# EAGLE design quadcopter (EAGLE 9.7.0)
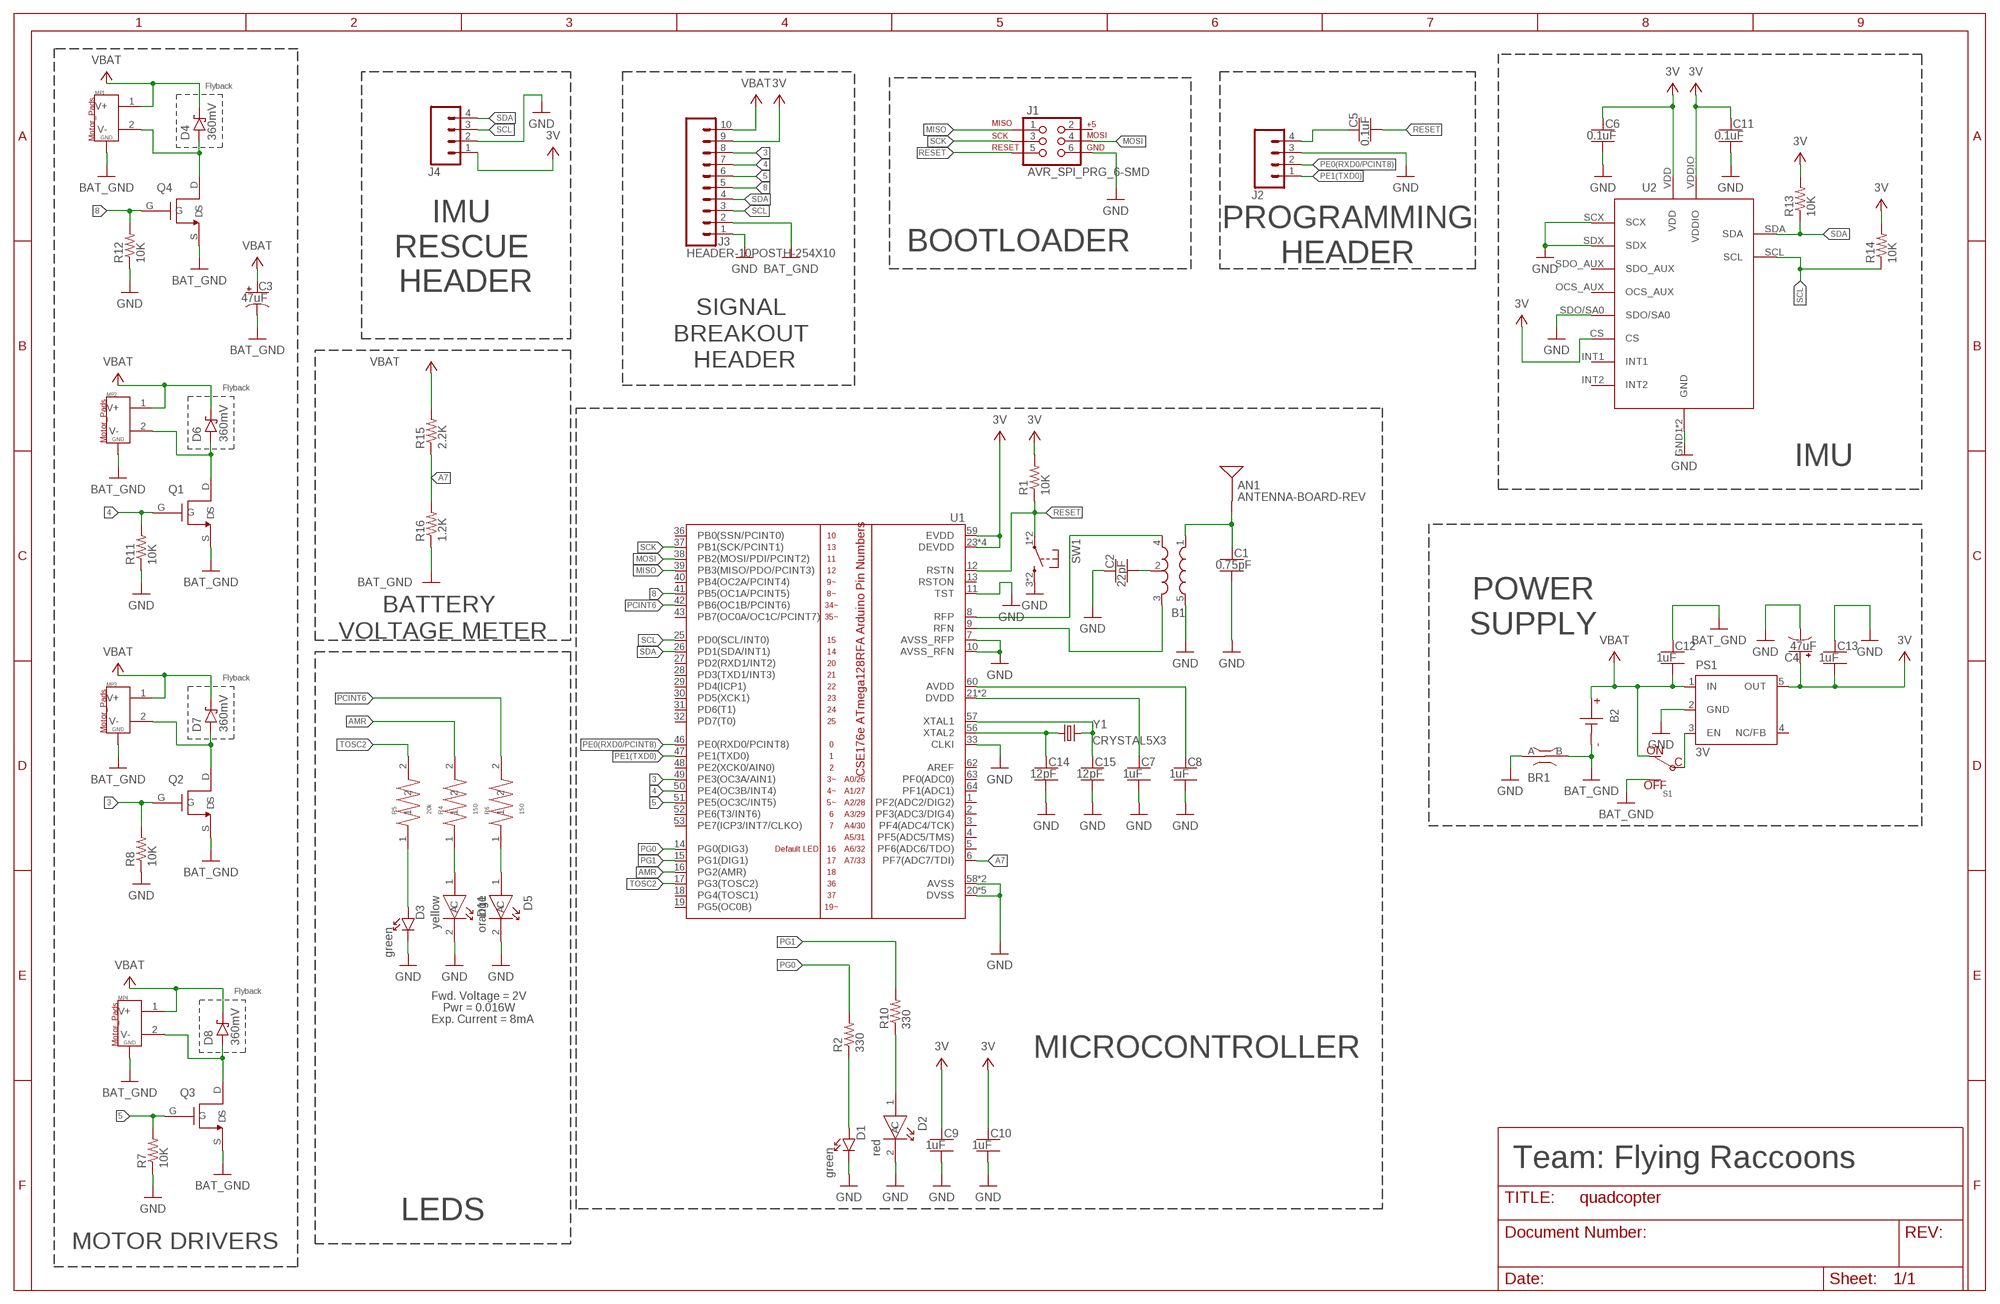
[diagram p0: schematic, sheet 1]
FRAME1 (FRAME_B_L): CREATOR: Unknown; DIST: Unknown; DISTPN: Unknown

## Parts
AN1  ANTENNA-BOARD-REV  [ANT_PCB_2.4GHZ_NRF8001_1.6MM_1OZ_REV]
B1  BALUN0805  [BALUN]
B2  BATTERY-SCREW-TERMINAL  [SCREW-TERMINAL-1X2-2.54MM]
BR1  NET_BRIDGE-NET-BRIDGE  [BRIDGE]
C1  0.75pF  CAPACITOR-NP_SMD-2012-0805_CERAMIC-0.75PF  [CAPC2012X140_HS]
C2  22pF  CAPACITOR-NP_SMD-2012-0805_CERAMIC-22PF  [CAPC2012X140_HS]
C3  47uF  CAPACITOR-POL_47UF-SMD-1206-TAJA  [CAPMP3216X180]
C4  47uF  CAPACITOR-POL_47UF-SMD-1206-TAJA  [CAPMP3216X180]
C5  0.1uF  CAPACITOR-NP_SMD-2012-0805_CERAMIC-0.1UF  [CAPC2012X140_HS]
C6  0.1uF  CAPACITOR-NP_SMD-2012-0805_CERAMIC-0.1UF  [CAPC2012X140_HS]
C7  1uF  CAPACITOR-NP_SMD-2012-0805_CERAMIC-1UF  [CAPC2012X140_HS]
C8  1uF  CAPACITOR-NP_SMD-2012-0805_CERAMIC-1UF  [CAPC2012X140_HS]
C9  1uF  CAPACITOR-NP_SMD-2012-0805_CERAMIC-1UF  [CAPC2012X140_HS]
C10  1uF  CAPACITOR-NP_SMD-2012-0805_CERAMIC-1UF  [CAPC2012X140_HS]
C11  0.1uF  CAPACITOR-NP_SMD-2012-0805_CERAMIC-0.1UF  [CAPC2012X140_HS]
C12  1uF  CAPACITOR-NP_SMD-2012-0805_CERAMIC-1UF  [CAPC2012X140_HS]
C13  1uF  CAPACITOR-NP_SMD-2012-0805_CERAMIC-1UF  [CAPC2012X140_HS]
C14  12pF  CAPACITOR-NP_SMD-2012-0805_CERAMIC-12PF  [CAPC2012X140_HS]
C15  12pF  CAPACITOR-NP_SMD-2012-0805_CERAMIC-12PF  [CAPC2012X140_HS]
D1  green  DIODE-LED_SMD-2012-0805-GREEN  [LEDSC125X200X120-2_HS]
D2  red  LED-RED_D-C170EKT  [LED-LTST-C170EKT]
D3  green  DIODE-LED_SMD-2012-0805-GREEN  [LEDSC125X200X120-2_HS]
D4  360mV  DIODE-SCHOTTKY_-SMD-SOD123  [SODFL3516X96]
D5  orange  LED-ORANGE_D-LOR976  [LED-LTST-C170EKT]
D6  360mV  DIODE-SCHOTTKY_-SMD-SOD123  [SODFL3516X96]
D7  360mV  DIODE-SCHOTTKY_-SMD-SOD123  [SODFL3516X96]
D8  360mV  DIODE-SCHOTTKY_-SMD-SOD123  [SODFL3516X96]
D11  yellow  LED-YELLOW_D-LYR976  [LED-LTST-C170EKT]
J1  AVR_SPI_PRG_6-SMD  [2X3-SMD]
J2  HEADER-4POS-0.1IN-FEMALE-SMD-BOTTOM-ENTRY  [HEADER-1X4-BOTTOM-ENTRY]
J3  HEADER-10POSTH-254X10  [HDRV10W63P254_10X1_2540X254H838_HS]
J4  HEADER-4POS-0.1IN-FEMALE-SMD-BOTTOM-ENTRY  [HEADER-1X4-BOTTOM-ENTRY]
MP1  MOTOR_PADS_GND-MOLEX-SMD  [MOLEX-0532610271]
MP2  MOTOR_PADS_GND-MOLEX-SMD  [MOLEX-0532610271]
MP3  MOTOR_PADS_GND-MOLEX-SMD  [MOLEX-0532610271]
MP4  MOTOR_PADS_GND-MOLEX-SMD  [MOLEX-0532610271]
PS1  3V  TPS73633-DBVT3V  [SOT23-DBV]
Q1  NMOSFET  [SOTFL95P237X112-3N]
Q2  NMOSFET  [SOTFL95P237X112-3N]
Q3  NMOSFET  [SOTFL95P237X112-3N]
Q4  NMOSFET  [SOTFL95P237X112-3N]
R1  10K  RESISTOR_SMD-2012-0805-10K  [RESC2012X60_HS]
R2  330  RESISTOR_SMD-2012-0805-330  [RESC2012X60_HS]
R4  150  RESISTOR-150R-0805  [0805_RESISTOR]
R5  20k  RESISTOR-20K-0805  [0805_RESISTOR]
R6  150  RESISTOR-150R-0805  [0805_RESISTOR]
R7  10K  RESISTOR_SMD-2012-0805-10K  [RESC2012X60_HS]
R8  10K  RESISTOR_SMD-2012-0805-10K  [RESC2012X60_HS]
R10  330  RESISTOR_SMD-2012-0805-330  [RESC2012X60_HS]
R11  10K  RESISTOR_SMD-2012-0805-10K  [RESC2012X60_HS]
R12  10K  RESISTOR_SMD-2012-0805-10K  [RESC2012X60_HS]
R13  10K  RESISTOR_SMD-2012-0805-10K  [RESC2012X60_HS]
R14  10K  RESISTOR_SMD-2012-0805-10K  [RESC2012X60_HS]
R15  2.2K  RESISTOR_SMD-2012-0805-2.2K  [RESC2012X60_HS]
R16  1.2K  RESISTOR_SMD-2012-0805-1.2K  [RESC2012X60_HS]
S1  POWER-SWITCH-MFS201N-9-Z-SMD-EDGE  [JS102011SAQN]
SW1  PUSHBUTTON_-4.5X4.5  [4.5MM_TACTILE_SWITCH_TL3305AF160QG]
U1  ATMEGA128RFA1  [QFN-64]
U2  IMU_LSM6DS0XTR-IMU-LSM6DS0XTR  [IMU_LSM6DS0XTR]
Y1  CRYSTAL5X3  [CRYSTAL-SMD-5X3]

## Nets
3: J3.8 Q2.G R8.2 U1.49(PE3(OC3A/AIN1))
3V [PWR]: C4.1(+) C6.1 C9.1 C10.1 C11.1 C13.2 J3.9 J4.1 PS1.5(OUT) R1.2 R13.2 R14.2 U1.23(DEVDD) U1.34(DEVDD) U1.44(DEVDD) U1.54(DEVDD) U1.59(EVDD) U2.CS U2.VDD U2.VDDIO
4: J3.7 Q1.G R11.2 U1.50(PE4(OC3B/INT4))
5: J3.6 Q3.G R7.2 U1.51(PE5(OC3C/INT5))
8: J3.5 Q4.G R12.2 U1.41(PB5(OC1A/PCINT5))
A7: R15.1 R16.2 U1.6(PF7(ADC7/TDI))
AMR: R4.2 U1.16(PG2(AMR))
BAT_GND [HIGHCURRENT]: B2.1(N) BR1.B C3.2(-) C12.1 J3.2 MP1.G1(GND) MP1.G2(GND) MP2.G1(GND) MP2.G2(GND) MP3.G1(GND) MP3.G2(GND) MP4.G1(GND) MP4.G2(GND) Q1.S Q2.S Q3.S Q4.S R16.1 S1.A(OFF)
GND [PWR]: B1.5(GND) BR1.A C1.2 C2.1 C4.2(-) C6.2 C7.2 C8.2 C9.2 C10.2 C11.2 C13.1 C14.2 C15.2 D1.C D2.2(C) D3.C D5.2(C) D11.2(C) J1.6 J2.3 J3.1 J4.2 PS1.2(GND) R7.1 R8.1 R11.1 R12.1 SW1.3 SW1.4 U1.7(AVSS_RFP) U1.10(AVSS_RFN) U1.11(TST) U1.20(DVSS) U1.24(DVSS) U1.33(CLKI) U1.35(DVSS) U1.45(DVSS) U1.55(DVSS) U1.58(AVSS) U1.61(AVSS) U2.GND1(GND) U2.GND2(GND) U2.SCX U2.SDO/SA0 U2.SDX
MISO: J1.1 U1.39(PB3(MISO/PDO/PCINT3))
MOSI: J1.4 U1.38(PB2(MOSI/PDI/PCINT2))
N$1: B1.4(OUT1) U1.8(RFP)
N$2: C15.1 U1.57(XTAL1) Y1.3
N$3: C14.1 U1.56(XTAL2) Y1.1
N$4: C7.1 U1.21(DVDD) U1.22(DVDD)
N$5: C8.1 U1.60(AVDD)
N$6: B1.3(OUT2) U1.9(RFN)
N$7: B1.2(GND) C2.2
N$8 [RFSIG]: AN1.FEED(SIGNAL) B1.1(IN) C1.1
N$9: D1.A R2.1
N$10: D2.1(A) R10.1
N$11: PS1.3(EN) S1.C
N$12: D3.A R5.1
N$13: D11.1(A) R4.1
N$14: D5.1(A) R6.1
N$15: C5.1 J2.4
N$16 [HIGHCURRENT]: D6.2(A) MP2.2(V-) Q1.D
N$17 [HIGHCURRENT]: D7.2(A) MP3.2(V-) Q2.D
N$18 [HIGHCURRENT]: D8.2(A) MP4.2(V-) Q3.D
N$19 [HIGHCURRENT]: D4.2(A) MP1.2(V-) Q4.D
PCINT6: R6.2 U1.42(PB6(OC1B/PCINT6))
PE0(RXD0/PCINT8): J2.2 U1.46(PE0(RXD0/PCINT8))
PE1(TXD0): J2.1 U1.47(PE1(TXD0))
PG0: R2.2 U1.14(PG0(DIG3))
PG1: R10.2 U1.15(PG1(DIG1))
RESET: C5.2 J1.5 R1.1 SW1.1 SW1.2 U1.12(RSTN)
SCK: J1.3 U1.37(PB1(SCK/PCINT1))
SCL: J3.3 J4.3 R14.1 U1.25(PD0(SCL/INT0)) U2.SCL
SDA: J3.4 J4.4 R13.1 U1.26(PD1(SDA/INT1)) U2.SDA
TOSC2: R5.2 U1.17(PG3(TOSC2))
VBAT [HIGHCURRENT]: B2.2(P) C3.1(+) C12.2 D4.1(C) D6.1(C) D7.1(C) D8.1(C) J3.10 MP1.1(V+) MP2.1(V+) MP3.1(V+) MP4.1(V+) PS1.1(IN) R15.2 S1.B(ON)
Unconnected: J1.2 PS1.4(NC/FB) U1.1(PF2(ADC2/DIG2)) U1.2(PF3(ADC3/DIG4)) U1.3(PF4(ADC4/TCK)) U1.4(PF5(ADC5/TMS)) U1.5(PF6(ADC6/TDO)) U1.13(RSTON) U1.18(PG4(TOSC1)) U1.19(PG5(OC0B)) U1.27(PD2(RXD1/INT2)) U1.28(PD3(TXD1/INT3)) U1.29(PD4(ICP1)) U1.30(PD5(XCK1)) U1.31(PD6(T1)) U1.32(PD7(T0)) U1.36(PB0(SSN/PCINT0)) U1.40(PB4(OC2A/PCINT4)) U1.43(PB7(OC0A/OC1C/PCINT7)) U1.48(PE2(XCK0/AIN0)) U1.52(PE6(T3/INT6)) U1.53(PE7(ICP3/INT7/CLKO)) U1.62(AREF) U1.63(PF0(ADC0)) U1.64(PF1(ADC1)) U2.INT1 U2.INT2 U2.OCS_AUX U2.SDO_AUX

## Notes on the sheet
- Flyback
- PROGRAMMING
  HEADER
- IMU 
  RESCUE 
  HEADER
- BOOTLOADER
- SIGNAL 
  BREAKOUT 
  HEADER
- Flyback
- IMU
- POWER
  SUPPLY
- BATTERY 
  VOLTAGE METER
- Flyback
- Flyback
- Fwd. Voltage = 2V
- Pwr = 0.016W
- Exp. Current = 8mA
- MICROCONTROLLER
- Team: Flying Raccoons
- LEDS
- MOTOR DRIVERS

## Library data of the parts
AN1 = quadparts_prebuilt_2022:ANTENNA: Single endded antenna.; CREATOR: Swanson; DESC: trace antenna; DIST: NA; DISTPN: NA; MFR: NA; MOUNTING: NONE; MPN: NA; POPULATE: NO
B1 = quadparts_prebuilt_2022:BALUN: A balun to convert differential radio-frequency outputs from the microcontroller into a single-ended driver for the antenna.; CREATOR: Swanson; DATASHEET: http://katalog.we-online.de/pbs/datasheet/748421245.pdf; DESC: BALUN 2.4GHZ-2.5GHZ 50/100 0805; DIST: Digikey; DISTPN: 732-2230-1-ND; MFR: Wurth Electronics Inc.; MOUNTING: SMD; MPN: 748421245; PACKAGE: 0805; PRICE: 2.63; REVIEWER: Swanson
B2 = quadparts_prebuilt_2022:BATTERY: Connections for a battery.; CREATOR: Swanson; DIST: DIGIKEY; DISTPN: ED10561-ND; MOUNTING: TH; PIN1: -; PIN2: +
BR1 = custom_anish:NET_BRIDGE; CREATOR: Anish Kulkarni; DIST: N/A; DISTPN: N/A
C1 = quadparts_prebuilt_2022:CAPACITOR-NP_: Nonpolarized capacitor; CREATOR: Swanson; DESC: CAP CER 0.75PF 100V C0G/NP0 0805; DIST: Digikey; DISTPN: 490-3585-1-ND; MFR: Murata Electronics; MOUNTING: SMD; MPN: GQM2195C2AR75CB01D; PACKAGE: 0805; REVIEWER: Swanson
C2 = quadparts_prebuilt_2022:CAPACITOR-NP_: Nonpolarized capacitor; CREATOR: Swanson; DESC: CAP CER 22PF 250V C0G/NP0 0805; DIST: Digikey; DISTPN: 490-5534-1-ND; MFR: Murata Electronics; MOUNTING: SMD; MPN: GRM21A5C2E220JW01D; PACKAGE: 0805; REVIEWER: Swanson
C3 C4 = quadparts_prebuilt_2022:CAPACITOR-POL_: Polarized capacitor; CREATOR: Swanson; DESC: CAP TANT 47UF 10% 6.3V 1206; DIST: DIGIKEY; DISTPN: 478-11462-1-ND; MFR: AVX Corporation; MOUNTING: SMD; MPN: TAJA476K006SNJV; PACKAGE: 1206
C5 C6 C11 = quadparts_prebuilt_2022:CAPACITOR-NP_: Nonpolarized capacitor; CREATOR: Swanson; DESC: CAP CER 0.1UF 100V X7R 0805; DIST: Digikey; DISTPN: 445-1418-1-ND; MFR: TDK Corporation; MOUNTING: SMD; MPN: C2012X7R2A104K125AA; PACKAGE: 0805; REVIEWER: Swanson
C7-C10 C12 C13 = quadparts_prebuilt_2022:CAPACITOR-NP_: Nonpolarized capacitor; CREATOR: Swanson; DIST: Digikey; DISTPN: 587-1281-1-ND; MFR: Taiyo Yuden; MOUNTING: SMD; MPN: TMK212B7105KG-T; REVIEWER: Swanson
C14 C15 = quadparts_prebuilt_2022:CAPACITOR-NP_: Nonpolarized capacitor; CREATOR: Swanson; DESC: CAP CER 12PF 250V C0G/NP0 0805; DIST: Digikey; DISTPN: 490-5531-1-ND; MFR: Murata Electronics; MOUNTING: SMD; MPN: GRM21A5C2E120JW01D; PACKAGE: 0805; REVIEWER: Swanson
D1 D3 = quadparts_prebuilt_2022:DIODE-LED_: Light emitting diode; CREATOR: Swanson; DIST: Digikey; DISTPN: 160-1179-1-ND; MFR: Lite-On Inc; MOUNTING: SMD; MPN: LTST-C170GKT; REVIEWER: Swanson
D2 = custom_anish:LED; CREATOR: Anish Kulkarni; DIST: Digikey; DISTPN: 160-1178-1-ND
D4 D6-D8 = quadparts_prebuilt_2022:DIODE-SCHOTTKY_: Schottky diode; CREATOR: Swanson; DESC: DIODE SCHOTTKY 30V 1.5A SFLAT; DIST: Digikey; DISTPN: CRS08QMCT-ND; MFR: Toshiba Semiconductor and Storage; MOUNTING: SMD; MPN: CRS08(TE85L,Q,M); REVIEWER: Swanson
D5 = custom_anish:LED; CREATOR: Anish Kulkarni; DIST: Digikey; DISTPN: 475-LOR976-PS-1CT-ND
D11 = custom_anish:LED; CREATOR: Anish Kulkarni; DIST: Digikey; DISTPN: 475-LYR976-PS-36-0-20-R18CT-ND
J1 = quadparts_prebuilt_2022:AVR_SPI_PRG_6: AVR ISP 6 Pin This is the in-system programming (ISP) connector for Atmel Microcontrollers programming.; CREATOR: Swanson; DESC: CONN HEADER SMD 6POS 2.54MM; DIST: Digikey; DISTPN: 609-3487-2-ND; MFR: Amphenol ICC (FCI); MOUNTING: SMD; MPN: 95278-101A06LF
J2 J4 = quadparts_prebuilt_2022:HEADER-4POS; CREATOR: Swanson; DESC: CONN RCPT 4POS 0.1 GOLD SMD; DIST: DIGIKEY; DISTPN: A121787CT-ND; MFR: TE Connectivity AMP Connectors; MOUNTING: SMD; MPN: 1241152-4
J3 = quadparts_prebuilt_2022:HEADER-10POS: 10 pin single inline pin header, socket, or connector; CREATOR: Swanson; DATASHEET: http://portal.fciconnect.com/Comergent//fci/drawing/68000.pdf; DIST: Digikey; DISTPN: 609-3250-ND; MFR: Amphenol FCI; MOUNTING: TH; MPN: 68000-110HLF; PRICE: 0.55; REVIEWER: Swanson
MP1-MP4 = quadparts_prebuilt_2022:MOTOR_PADS_GND: Connections a brushed motor.; CREATOR: Swanson; DESC: CONN HEADER SMD R/A 2POS 1.25MM; DIST: DIGIKEY; DISTPN: WM7620CT-ND; MFR: Molex; MOUNTING: SMD; MPN: 532610271
PS1 = quadparts_prebuilt_2022:TPS73633-DBVT: LP3985-series voltage regulators.; CREATOR: Swanson; DATASHEET: http://www.ti.com/lit/ds/symlink/lp3985.pdf; DIST: Digikey; DISTPN: LP3985IM5X-3.0/NOPBCT-ND; MFR: Texas Instruments; MOUNTING: SMD; MPN: LP3985IM5X-3.0/NOPB; PRICE: 0.59; REVIEWER: Swanson
Q1-Q4 = custom_girish:NMOSFET; CREATOR: GIRISH K; DIST: Digikey; DISTPN: SI2302CDS-T1-E3CT-ND
R1 R7 R8 R11-R14 = quadparts_prebuilt_2022:RESISTOR_: Resistor; CREATOR: Swanson; DESC: RES SMD 10K OHM 5% 1/8W 0805; DIST: Digikey; DISTPN: 311-10KARCT-ND; MFR: Yageo; MOUNTING: SMD; MPN: RC0805JR-0710KL; PACKAGE: 0805; REVIEWER: Swanson
R2 R10 = quadparts_prebuilt_2022:RESISTOR_: Resistor; CREATOR: Swanson; DIST: Digikey; DISTPN: 311-330ARCT-ND; MFR: Yageo; MOUNTING: SMD; MPN: RC0805JR-07330RL; REVIEWER: Swanson
R4 R6 = custom_girish:RESISTOR; CREATOR: GIRISH K; DIST: Digikey; DISTPN: CR0805-FX-1500ELFCT-ND
R5 = custom_girish:RESISTOR; CREATOR: GIRISH K; DIST: Digikey; DISTPN: P20KDACT-ND
R15 = quadparts_prebuilt_2022:RESISTOR_: Resistor; CREATOR: SWANSON; DIST: DIGIKEY; DISTPN: YAG3776CT-ND; MOUNTING: SMD
R16 = quadparts_prebuilt_2022:RESISTOR_: Resistor; CREATOR: Swanson; DESC: RES SMD 1.2K OHM 1% 1/8W 0805; DIST: DIGIKEY; DISTPN: 311-1.20KCRCT-ND; MFR: Yageo; MOUNTING: SMD; MPN: RC0805FR-071K2L; PACKAGE: 0805
S1 = quadparts_prebuilt_2022:POWER-SWITCH-MFS201N-9-Z; CREATOR: Swanson; DESC: SWITCH SLIDE SPDT 300MA 6V; DIST: DIGIKEY; DISTPN: 401-1999-1-ND; MFR: C&K; MOUNTING: SMD; MPN: JS102011SAQN
SW1 = quadparts_prebuilt_2022:PUSHBUTTON_: "Tactile" or "clicky" button.; CREATOR: Swanson; DESC: SWITCH TACTILE SPST-NO 50MA 12V; DIST: DIGIKEY; DISTPN: EG5350CT-ND; MFR: E-Switch; MOUNTING: SMD; MPN: TL3305AF160QG
U1 = quadparts_prebuilt_2022:ATMEGA128RFA1: ATmega128RFA1 8-bit AVR Microcontroller with Low Power 2.4GHz Transceiver for ZigBee and IEEE 802.15.4; CREATOR: Swanson; DATASHEET: http://www.atmel.com/Images/Atmel-8266-MCU_Wireless-ATmega128RFA1_Datasheet.pdf; DESC: IC RF TXRX+MCU 802.15.4 64VFQFN; DIST: Digikey; DISTPN: ATMEGA128RFA1-ZU-ND; MFR: Microchip Technology; MOUNTING: SMD; MPN: ATMEGA128RFA1-ZU; PACKAGE: QFN; PRICE: 10.21; REVIEWER: Swanson
U2 = custom_girish:IMU_LSM6DS0XTR; CREATOR: GIRISH K; DIST: Digikey; DISTPN: 497-18367-1-ND
Y1 = quadparts_prebuilt_2022:CRYSTAL: Crystals to provide clock references for microcontrollers, etc.; CREATOR: Swanson; DATASHEET: http://www.abracon.com/Resonators/abm3b.pdf; DESC: CRYSTAL 16.0000MHZ 18PF SMD; DIST: Digikey; DISTPN: 535-9122-1-ND; MFR: Abracon LLC; MOUNTING: SMD; MPN: ABM3B-16.000MHZ-B2-T; PRICE: 0.68; PROD_ID: XTAL-08218; REVIEWER: Swanson

## Net classes
1 RFSIG: width 1.27 mm
2 PWR: width 0.254 mm
3 HIGHCURRENT: width 0.762 mm, drill 0.61 mm

## Board
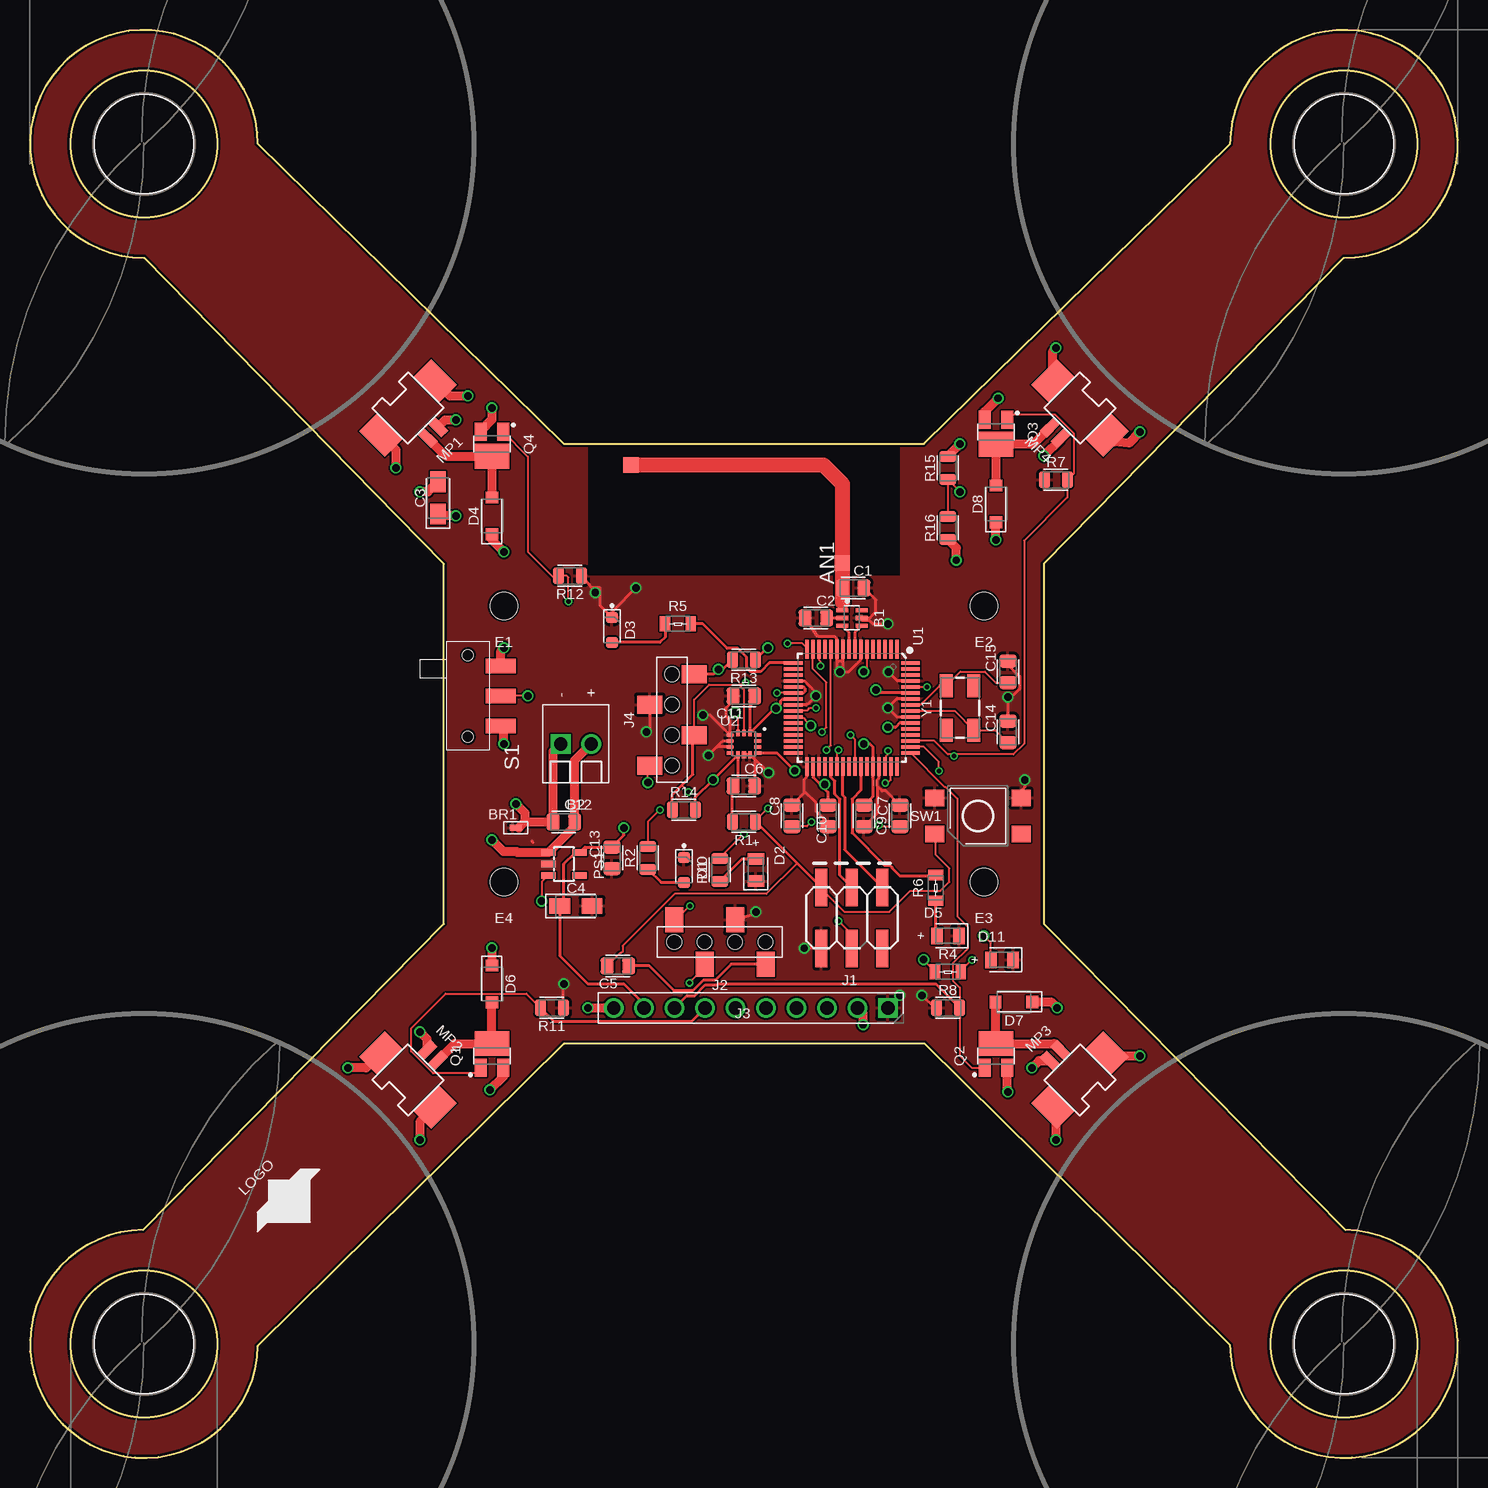
[diagram p1: board, top side]
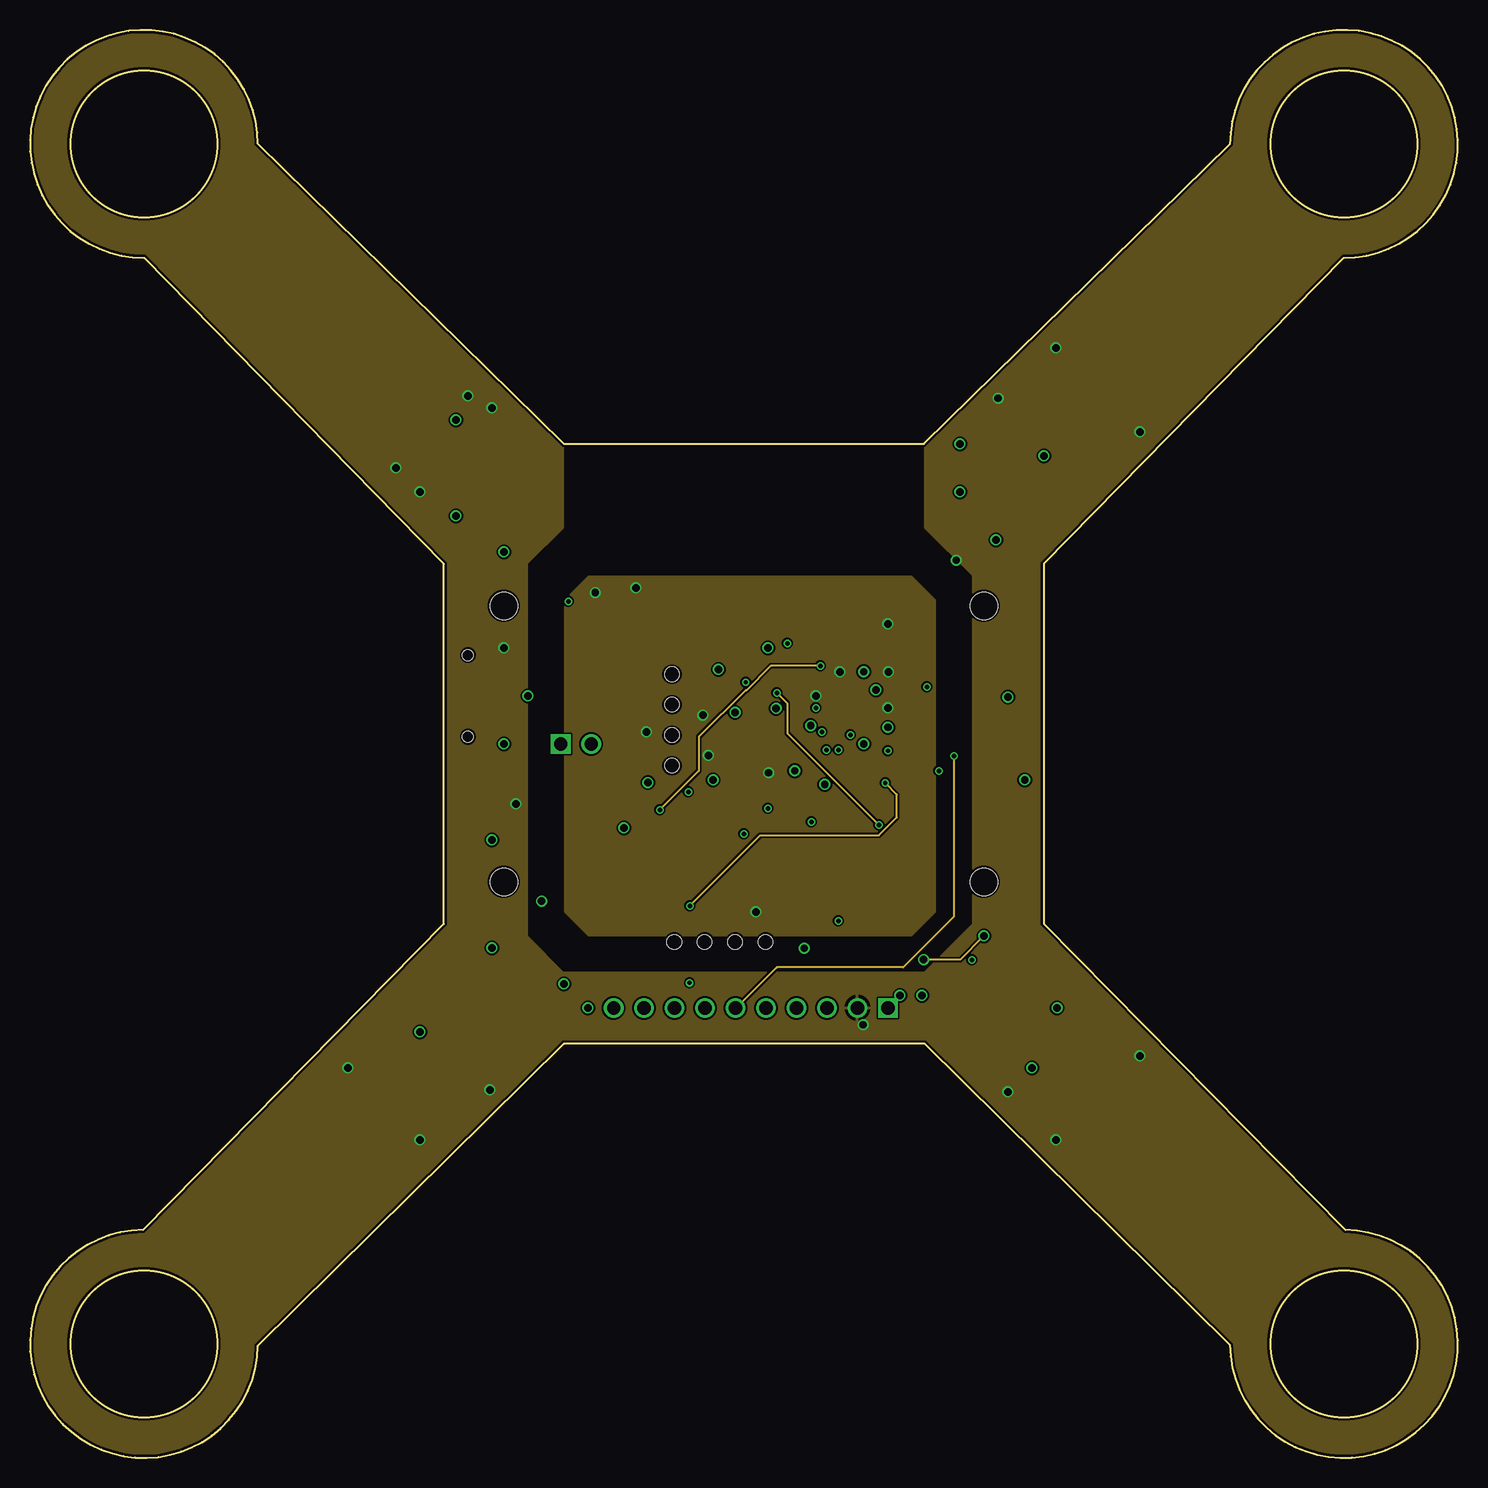
[diagram p2: board, inner layer Route2]
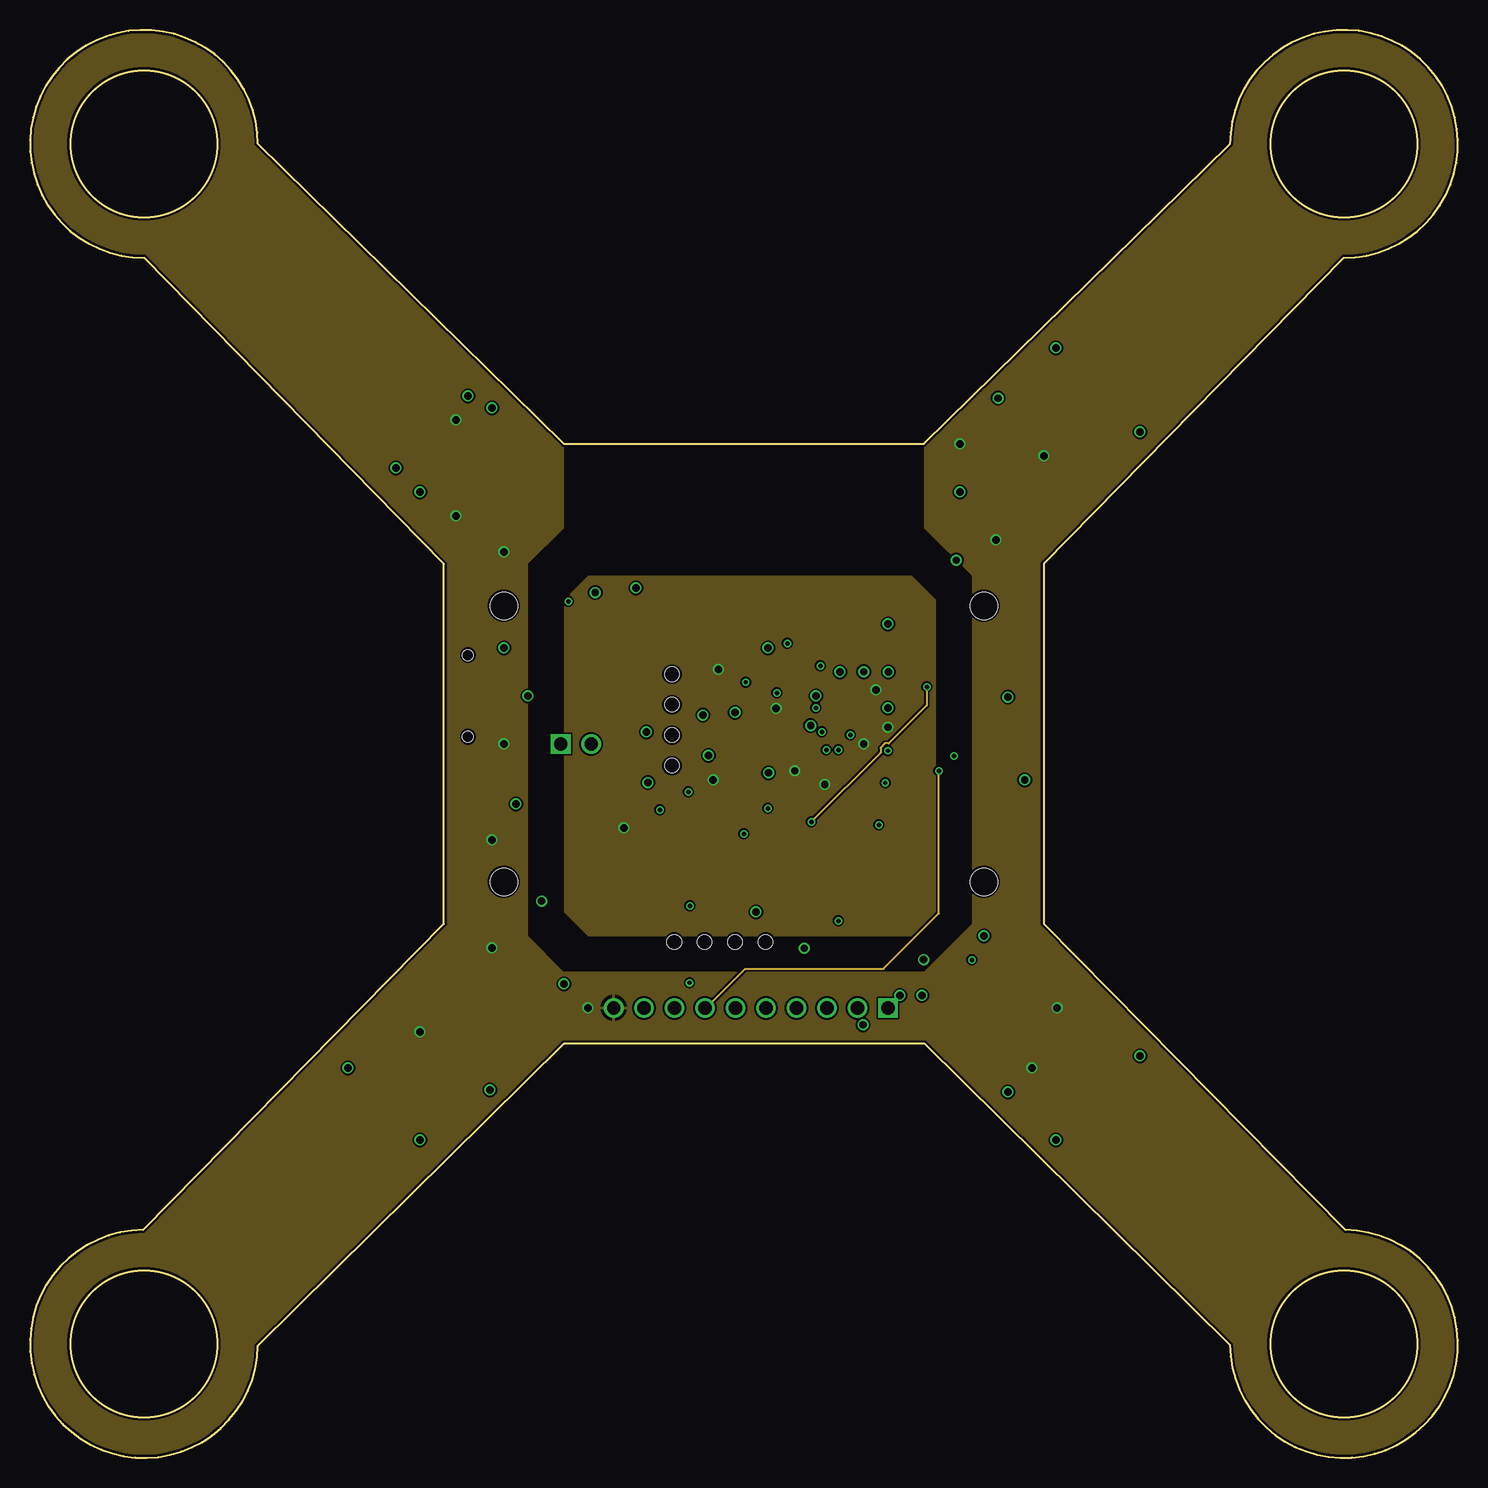
[diagram p3: board, inner layer Route15]
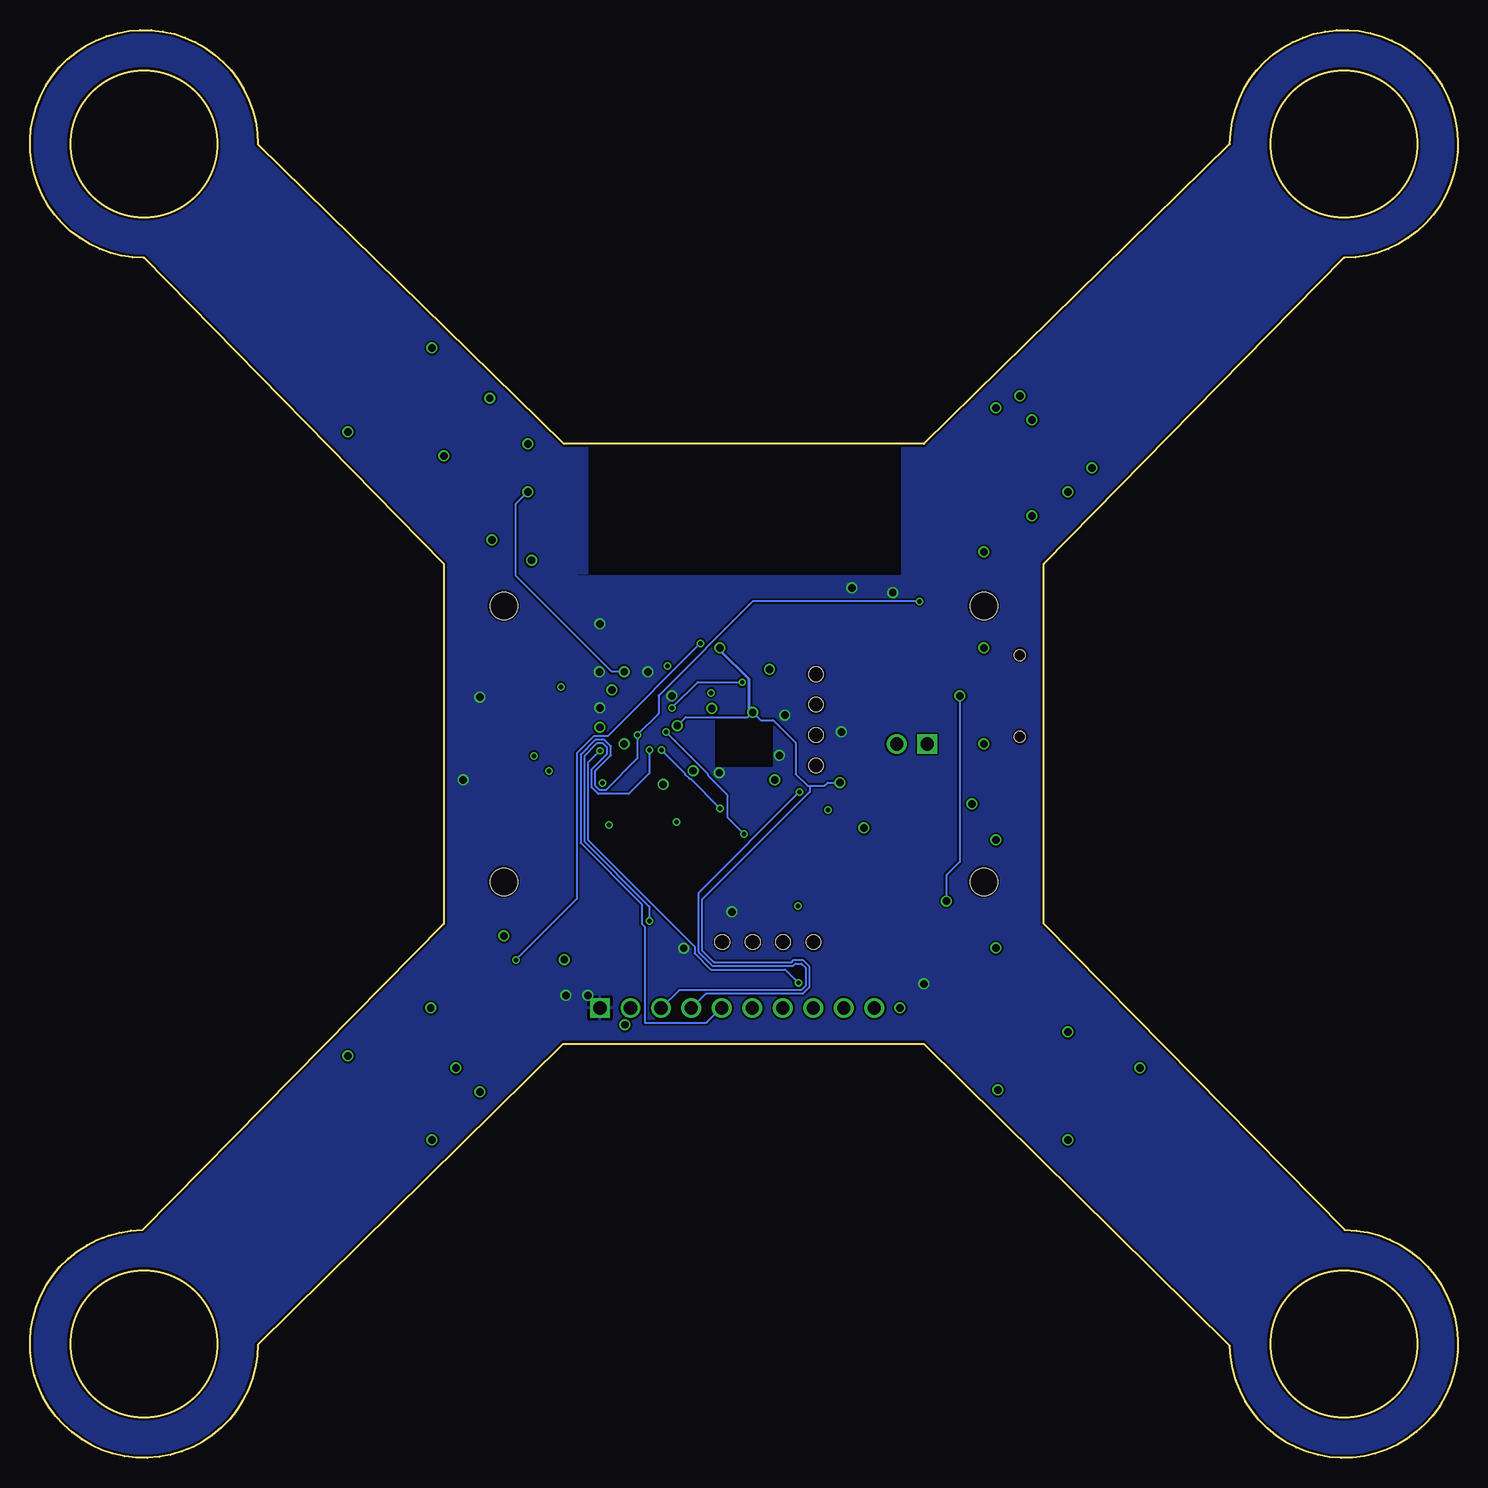
[diagram p4: board, bottom side, seen from below]

Size 118.99 x 118.99 mm. Coordinates in mm from the lower left corner, seen from the top.
Outline: 18.99,109.5 arc270 9.5,100 34.49,74.5 34.49,44.5 9.43,19 arc269 18.99,9.34 44.49,34.5 74.57,34.5 99.99,9.42 arc269 109.61,19 84.49,44.5 84.49,74.5 109.48,100 arc270 99.99,109.49 74.49,84.5 44.49,84.5 18.99,109.5
Outline: circle at 109.49,109.5 radius 6.1
Outline: circle at 9.49,109.5 radius 6.1
Outline: circle at 9.49,9.5 radius 6.1
Outline: circle at 109.49,9.5 radius 6.1
Copper layers (1*2*15*16): Top 0.035559375mm / dielectric 1.501140625mm / Route2 0.035559375mm / dielectric 0.149859375mm / Route15 0.035559375mm / dielectric 0.200659375mm / Bottom 0.035559375mm
Design rules "pcbcart-4layer-5mil-small-cream": minimum track width 5mil, minimum drill 8mil, track to track 6mil, track to pad 6mil, pad to pad 6mil, via to via 6mil, smd to smd 6mil, copper to edge 0.2mm, drill to drill 10mil, minimum pad ring 5mil, minimum via ring 5mil, stop-mask expansion 3mil, vias tented up to drill 0.45mm, thermal gap 10mil

### Footprints (pad centres in the part's own frame; a part is rotated, then mirrored left to right if it is on the bottom)
ANT_PCB_2.4GHZ_NRF8001_1.6MM_1OZ_REV = smd 1.27 x 1.27: FEED 0,0; TESTPOINT 8.169,17.605
BALUN = smd 0.35 x 1: 1 -0.65,-0.8; 2 0,-0.8; 3 0.65,-0.8; 4 0.65,0.8; 5 0,0.8; 6 -0.65,0.8
SCREW-TERMINAL-1X2-2.54MM = drill 1.1 square: 1 -1.27,0 | drill 1.1: 2 1.27,0
BRIDGE = smd 0.5 x 0.5: A -0.25,0; B 0.25,0
CAPC2012X140_HS = smd 1.08 x 1.42: 1 -0.895,0; 2 0.895,0
CAPMP3216X180 = smd 1.735 x 1.315: 1 -1.34,0; 2 1.34,0
LEDSC125X200X120-2_HS = smd 0.94 x 0.99: A -1.045,0; C 1.045,0
LED-LTST-C170EKT = smd 0.967 x 1.367: 1 -0.925,0; 2 0.925,0
SODFL3516X96 = smd 0.962 x 1.029: 1 -1.525,0; 2 1.525,0
2-56-MOUNTING-HOLE-NO-METAL = hole 2.261: 0,0
2X3-SMD = smd 1 x 3.15: 1 -2.54,-2.54; 2 -2.54,2.54; 3 0,-2.54; 4 0,2.54; 5 2.54,-2.54; 6 2.54,2.54
HEADER-1X4-BOTTOM-ENTRY = smd 1.5 x 2.1: 1 3.81,-1.85; 2 1.27,1.85; 3 -1.27,-1.85; 4 -3.81,1.85 | hole 1.2: -1.27,0; -3.81,0; 1.27,0; 3.81,0
HDRV10W63P254_10X1_2540X254H838_HS = drill 1.1 pad 1.65 square: 1 0,0 | drill 1.1 pad 1.65: 2 2.54,0; 3 5.08,0; 4 7.62,0; 5 10.16,0; 6 12.7,0; 7 15.24,0; 8 17.78,0; 9 20.32,0; 10 22.86,0
MOLEX-0532610271 = smd 0.8 x 1.6: 1 -0.637,2.9; 2 0.613,2.9 | smd 2.1 x 3: G1 -3.175,0; G2 3.175,0
SOT23-DBV = smd 0.55 x 1.2: 1 -0.95,-1.3; 2 0,-1.3; 3 0.95,-1.3; 4 0.95,1.3; 5 -0.95,1.3
SOTFL95P237X112-3N = smd 2.05 x 2.9: D 1.025,0 | smd 1.5 x 1: G -1,0.95; S -1,-0.95
RESC2012X60_HS = smd 0.92 x 1.38: 1 -0.955,0; 2 0.955,0
0805_RESISTOR = smd 0.85 x 1.25: 1 -1.075,0; 2 1.075,0
JS102011SAQN = smd 1.2 x 2.5: A -2.5,2.75; B 2.5,2.75; C 0,2.75 | hole 0.9: -3.4,0; 3.4,0
4.5MM_TACTILE_SWITCH_TL3305AF160QG = smd 1.6 x 1.4: 1 -3.6,-1.5; 2 3.6,-1.5; 3 -3.6,1.5; 4 3.6,1.5
QFN-64 = smd 1.562 x 0.28: 1 -4.881,3.75; 2 -4.881,3.25; 3 -4.881,2.75; 4 -4.881,2.25; 5 -4.881,1.75; 6 -4.881,1.25; 7 -4.881,0.75; 8 -4.881,0.25; 9 -4.881,-0.25; 10 -4.881,-0.75; 11 -4.881,-1.25; 12 -4.881,-1.75; 13 -4.881,-2.25; 14 -4.881,-2.75; 15 -4.881,-3.25; 16 -4.881,-3.75; 33 4.881,-3.75; 34 4.881,-3.25; 35 4.881,-2.75; 36 4.881,-2.25; 37 4.881,-1.75; 38 4.881,-1.25; 39 4.881,-0.75; 40 4.881,-0.25; 41 4.881,0.25; 42 4.881,0.75; 43 4.881,1.25; 44 4.881,1.75; 45 4.881,2.25; 46 4.881,2.75; 47 4.881,3.25; 48 4.881,3.75 | smd 0.28 x 1.562: 17 -3.75,-4.881; 18 -3.25,-4.881; 19 -2.75,-4.881; 20 -2.25,-4.881; 21 -1.75,-4.881; 22 -1.25,-4.881; 23 -0.75,-4.881; 24 -0.25,-4.881; 25 0.25,-4.881; 26 0.75,-4.881; 27 1.25,-4.881; 28 1.75,-4.881; 29 2.25,-4.881; 30 2.75,-4.881; 31 3.25,-4.881; 32 3.75,-4.881; 49 3.75,4.881; 50 3.25,4.881; 51 2.75,4.881; 52 2.25,4.881; 53 1.75,4.881; 54 1.25,4.881; 55 0.75,4.881; 56 0.25,4.881; 57 -0.25,4.881; 58 -0.75,4.881; 59 -1.25,4.881; 60 -1.75,4.881; 61 -2.25,4.881; 62 -2.75,4.881; 63 -3.25,4.881; 64 -3.75,4.881
IMU_LSM6DS0XTR = smd 0.29 x 0.575: CS 0.5,0.912; GND2 0.5,-0.912; SCL 0,0.912; SDA -0.5,0.912; VDDIO -0.5,-0.912 | smd 0.35 x 0.575: GND1 0,-0.912 | smd 0.575 x 0.29: INT1 -1.163,-0.75; INT2 1.163,-0.25; OCS_AUX 1.163,0.25; SCX -1.163,-0.25; SDO/SA0 -1.163,0.75; SDO_AUX 1.163,0.75; SDX -1.163,0.25; VDD 1.163,-0.75
CRYSTAL-SMD-5X3 = smd 1.9 x 1.1: 1 -1.85,-1.15; 2 1.85,-1.15; 3 1.85,1.15; 4 -1.85,1.15

### Placement (x,y rotation side)
AN1  67.69,74.58 90 top
B1  68.49,70 270 top
B2  45.49,59.5 0 top
BR1  40.49,52.5 0 top
C1  68.59,72.5 0 top
C2  65.49,70 0 top
C3  33.99,80 90 top
C4  45.49,46 0 top
C5  48.99,41 180 top
C6  59.49,56 0 top
C7  72.49,53.5 90 top
C8  63.49,53.5 90 top
C9  69.49,53.5 270 top
C10  66.49,53.5 270 top
C11  59.49,63.5 180 top
C12  44.49,53 0 top
C13  48.49,50 90 top
C14  81.49,60.5 90 top
C15  81.49,65.5 90 top
D1  54.49,49 90 top
D2  60.49,49 270 top
D3  48.49,69 90 top
D4  38.49,78.5 90 top
D5  76.49,43.5 0 top
D6  38.49,39.5 270 top
D7  81.99,38 180 top
D8  80.49,79.5 90 top
D11  80.99,41.5 0 top
E1  [2-56-MOUNTING-HOLE-NO-METAL]  39.49,71 0 top
E2  [2-56-MOUNTING-HOLE-NO-METAL]  79.49,71 0 top
E3  [2-56-MOUNTING-HOLE-NO-METAL]  79.49,48 0 top
E4  [2-56-MOUNTING-HOLE-NO-METAL]  39.49,48 0 top
E$1  [LAYER_LABELS]  -37.51,138.5 0 top  (outside the outline)
J1  68.49,45 180 top
J2  57.49,43 180 top
J3  71.49,37.5 180 top
J4  53.49,61.5 90 top
LOGO  [DECORATIONS]  22.49,20.5 225 top
MP1  31.49,87.5 225 top
MP2  31.49,31.5 315 top
MP3  87.49,31.5 45 top
MP4  87.49,87.5 135 top
P1  [MOTOR_AND_PROP]  9.49,9.5 0 top
P2  [MOTOR_AND_PROP]  109.49,9.5 0 top
P3  [MOTOR_AND_PROP]  109.49,109.5 0 top
P4  [MOTOR_AND_PROP]  9.49,109.5 0 top
PS1  44.49,49.5 270 top
Q1  38.49,33.5 90 top
Q2  80.49,33.5 90 top
Q3  80.49,85.5 270 top
Q4  38.49,84.5 270 top
R1  59.49,53 180 top
R2  51.49,50 90 top
R4  76.49,40.5 0 top
R5  53.99,69.5 0 top
R6  75.49,47.5 90 top
R7  85.49,81.5 0 top
R8  76.49,37.5 0 top
R10  57.49,49 90 top
R11  43.49,37.5 180 top
R12  44.99,73.5 180 top
R13  59.49,66.5 180 top
R14  54.49,54 0 top
R15  76.49,82.5 90 top
R16  76.49,77.5 90 top
S1  36.49,63.5 270 top
SW1  78.99,53.5 0 top
U1  68.49,62.5 270 top
U2  59.49,59.5 0 top
Y1  77.49,62.5 90 top

### Tracks (layer width: path | path; a pad name or v marks a point on that pad's centre or on a via)
3
  Top 0.152: R8.2 77.49,37.45 | 77.49,37.45 77.49,33.5 78.49,32.5 Q2.G | U1.49 76.2,55.93 76.29,55.93 77.27,54.94 77.27,45.13 78.13,44.27 78.13,42.43 76.92,41.22 76.92,39.78 77.49,39.2 77.49,37.45
  Top 0.254: 77.49,37.45 77.49,37.5 75.49,39.5 57.34,39.5 57.26,39.41 56.29,39.41 55.4,38.52 54.74,38.52 J3.8
3V  (via drill 0.61, 0.61 pad 0.25)
  Top 0.254: 56.92,56.51 58.9,58.49 U2.VDDIO 58.99,56.39 C6.1 58.54,55.94 R1.2 | U1.59 70.74,63.75 v70.49,64 | U1.54 72.49,61.25 72.13,60.88 v71.49,60.88 | 56.92,56.51 v56.92,56.5 | C11.1 59.99,62.6 U2.CS 60.09,60.5 60.09,60.51 62.04,62.46 v62.17,62.46 62.55,62.84 62.55,63.08 62.7,63.22 63.59,63.22 U1.23 | U2.VDD 62.24,58.75 v63.73,57.26 | J4.1 56.97,65.31 v57.37,65.7 57.75,65.7 R13.2 | C10.1 66.49,55.48 66.28,55.69 | R14.2 55.45,55.04 56.92,56.51 | v69.48,59.5 69.99,59.5 70.24,59.25 U1.44 70.24,56.72 70.21,56.69 70.21,55.11 C9.1 | U1.34 65.27,57.59 65.27,56.7 66.28,55.69 | 66.28,55.69 66.28,56.07 v66.23,56.12 | J3.9 51.17,37.82 49.49,39.5 46.49,39.5 44.15,41.84 C4.1 44.49,46.34 44.49,49.5 45.44,50.45 PS1.5 46.24,50.89 C13.2 49.49,51.89 v49.49,52.5
  pour Route15: 46.53,43.57 73.46,43.57 75.42,45.53 75.42,71.47 73.46,73.42 46.53,73.42 44.57,71.47 44.57,45.53
4  (via drill 0.35)
  Top 0.152: Q1.G 37.08,32.04 33.6,32.04 31.76,33.88 31.76,35.8 34.64,38.68 41.35,38.68 R11.2 | U1.50 74.49,59.25 75.74,58 v75.74,57.25
  Top 0.254: R11.2 43.64,36.39 55.15,36.39 J3.7
  Route15 0.152: v75.74,57.25 75.74,45.37 71.12,40.75 59.62,40.75 56.37,37.5 J3.7
5  (via drill 0.35)
  Top 0.152: Q3.G 81.9,86.96 85.39,86.96 86.97,85.37 86.97,82.02 R7.2 86.45,80.05 82.84,76.44 82.84,59.52 81.94,58.62 76.99,58.62 | U1.51 75.37,59.75 76.49,58.62 76.99,58.62 | 76.99,58.62 v76.99,58.5
  Route2 0.152: J3.6 58.87,37.5 62.24,40.87 72.77,40.87 76.99,45.1 v76.99,58.5
8  (via drill 0.35)
  Top 0.152: Q4.G 41.49,83.45 41.49,75.5 43.56,73.43 R12.2 44.74,73.5 44.87,73.37 v44.87,71.37 | U1.41 68.74,59.87 v68.37,60.25
  Bottom 0.152: v44.87,71.37 58.74,71.37 66.6,63.51 66.6,62.01 v68.37,60.25 68.37,58.3 71.03,55.64 71.53,55.64 71.88,56 71.88,57.25 70.58,58.55 70.58,59.3 71.12,59.84 71.87,59.84 73.1,58.61 73.1,51.24 67.99,46.13 67.99,44.5 67.74,44.25 67.74,36.25 62.62,36.25 61.37,37.5 J3.5
A7  (via drill 0.61)
  Top 0.152: R16.2 R15.1 77.49,80.54 v77.49,80.5 | U1.6 69.74,65.78 v69.48,65.52
  Bottom 0.152: v69.48,65.52 70.51,65.52 78.49,73.5 78.49,79.5 v77.49,80.5
AMR  (via drill 0.35)
  Top 0.152: v78.49,41.5 77.62,40.62 R4.2 | v63.12,67.87 64.37,67.87 64.74,67.5 U1.16
  Bottom 0.152: v78.49,41.5 73.41,46.58 73.41,58.73 72,60.14 70.85,60.14 v63.12,67.87
BAT_GND  (via drill 0.61, 0.61 pad 0.25)
  Top 0.762: v81.49,30.5 81.44,30.55 Q2.S | v38.49,87.5 38.49,86.55 37.54,85.6 Q4.S | MP1.G2 30.49,84.01 v30.49,82.5 | MP1.G1 34.98,88.5 v36.49,88.5 | MP4.G1 90.32,84.67 91.57,84.57 v92.49,85.5 | MP4.G2 85.25,92.25 v85.49,92.5 | MP3.G1 85.49,29.01 v85.49,26.5 | MP3.G2 89.98,33.5 v92.49,33.5 | MP2.G1 28,32.5 v26.49,32.5 | MP2.G2 32.49,28.01 v32.49,26.5 | C3.2 33.15,80.5 v32.49,80.5 | S1.A 39.24,67.25 v39.49,67.5 | J3.2 69.42,37.03 v69.42,36.1 | R16.1 77.19,75.84 v77.19,74.8 | Q3.S 79.54,87.18 v80.68,88.31 | Q1.S 39.44,31.78 v38.33,30.66 | B2.1 43.6,58.87 C12.1 41.24,53 | BR1.B 41.24,53 | v40.49,54.5 41.24,53.75 41.24,53
  pour Route2: 44.42,115.47 33.46,126.42 4.48,126.42 4.45,126.43 -7.51,138.39 -11.43,134.47 -11.43,-8.47 -5.47,-14.43 130.42,-14.43 130.42,115.47 113.49,132.39 74.57,93.47 74.57,77.53 78.56,73.54 78.57,73.51 78.57,44.48 78.56,44.45 74.54,40.43 74.51,40.42 44.48,40.42 44.45,40.43 41.43,43.45 41.42,43.48 41.42,74.51 41.43,74.54 44.42,77.53
GND  (via drill 0.61 pad 0.35)
  Top 0.254: 47.49,72.5 46.8,72.5 R12.1 | v50.49,72.5 48.63,70.64 D3.C 47.49,71.04 47.49,72.5 | v60.49,45.5 60.34,45.35 J2.3 | v44.49,39.5 44.45,39.45 R11.1 | C1.2 70.49,71.5 70.49,70.5 69.99,70 B1.5 69.39,69.8 69.91,69.8 70.21,69.5 v71.49,69.5 | SW1.4 82.09,55.1 82.89,55.9 v82.89,56.5 | 60.44,55.44 C6.2 60.39,58.19 60.25,58.32 | 64.77,57.59 U1.33 64.74,56.76 64.49,56.51 64.49,55.39 C8.2 63.49,54.48 | U2.SCX 57.24,59.25 v56.54,58.54 57.74,59.75 U2.SDX | v67.49,65.5 67.74,65.75 U1.10 67.72,67.35 67.72,66.5 67.59,66.37 67.4,66.37 67.27,66.5 67.27,68.24 67.07,68.44 65.66,68.44 C2.1 | U1.11 67.24,65.75 v67.49,65.5 | U1.55 72.24,61.75 v71.49,62.5 72.24,63.25 U1.58 | C14.2 81.49,63.5 81.89,63.5 82.48,64.09 82.48,65.11 81.49,66.1 C15.2 | v72.49,38.54 71.49,37.54 J3.1 | v61.55,57.09 60.31,58.32 60.25,58.32 | U2.GND1 U2.GND2 60.09,58.49 | U2.GND2 60.09,58.49 | 60.09,58.49 60.25,58.32 | v56.08,61.9 56.67,61.9 U2.SDO/SA0 58.33,61.44 57.97,61.8 57.97,62.45 58.6,63.08 C11.2 | J4.2 51.64,60.77 v51.37,60.5 | U1.35 65.72,57.59 | U1.45 70.77,57.59 70.77,56.67 70.62,56.52 70.62,55.97 | U1.20 64.54,64.75 65.49,63.79 v65.49,63.5 64.81,62.81 64.73,62.81 64.66,62.75 U1.24 | R8.1 75.38,37.5 v74.33,38.55 | v67.49,65.5 68.22,65.5 69.24,66.53 U1.7 | 64.49,55.6 65.51,54.59 65.51,53.88 66.49,52.89 C10.2 | J1.6 65.94,42.48 v64.52,42.48 | 70.62,55.97 71.01,55.59 71.3,55.59 C7.2 | 70.62,55.97 70.62,53.73 C9.2 | U1.61 72.28,64.75 v71.53,65.49 | v47.1,72.11 47.11,72.11 47.49,72.5 | 41.82,51.39 41.82,51.38 41.91,51.28
  other vias: 81.49,63.4
  pour Route2: 46.53,43.57 73.46,43.57 75.42,45.53 75.42,71.47 73.46,73.42 46.53,73.42 44.57,71.47 44.57,45.53
  pour Bottom: 73.44,73.53 73.41,73.52 46.38,73.52 46.35,73.53 46.33,73.55 46.32,73.58 46.32,90.57 16.36,120.52 2.43,120.52 -2.53,115.57 -2.53,-8.33 126.36,-8.33 131.32,-3.37 131.32,119.57 127.36,123.52 80.43,123.52 72.57,115.57 72.57,73.67 73.41,73.67 73.44,73.66 73.46,73.64 73.47,73.61 73.47,73.58 73.46,73.55
  pour Top: 73.54,73.43 73.51,73.42 46.48,73.42 46.45,73.43 46.43,73.45 46.42,73.48 46.42,90.47 16.46,120.42 2.53,120.42 -2.43,115.47 -2.43,-8.43 126.46,-8.43 131.42,-3.47 131.42,119.47 127.46,123.42 80.53,123.42 72.57,115.47 72.57,73.57 73.51,73.57 73.54,73.56 73.56,73.54 73.57,73.51 73.57,73.48 73.56,73.45
MISO
  Top 0.254: U1.39 67.74,55.22 67.89,55.07 67.89,50.68 J1.1
MOSI  (via drill 0.35)
  Top 0.152: U1.38 67.24,58.87 v67.37,59 | v67.37,44.75 68.49,43.62 J1.4
  Bottom 0.152: v67.37,44.75 67.37,45.94 72.8,51.37 72.8,58.48 71.75,59.53 71.24,59.53 70.89,59.18 70.89,58.68 72.19,57.37 72.19,55.87 71.66,55.33 69.09,55.33 67.37,57.05 v67.37,59
N$1
  Top 0.254: U1.8 68.74,68.8 B1.4
N$2
  Top 0.152: C15.1 80.49,64.6 79.57,65.53 77.52,65.53 Y1.3 75.79,64.35 74.27,62.82 73.45,62.82 U1.57
N$3
  Top 0.152: U1.56 77.04,62.25 Y1.1 80.45,60.65 C14.1
N$4  (via drill 0.35)
  Top 0.152: v70.74,52.75 70.87,52.62 72.49,52.62 C7.1 | U1.22 v62.24,63.75
  Top 0.254: U1.21 63.64,64.22 64.49,64.22 64.62,64.09 64.62,63.9 64.49,63.77 63.64,63.77 U1.22
  Route2 0.152: v62.24,63.75 63.12,62.87 63.12,60.37 v70.74,52.75
N$5  (via drill 0.35)
  Top 0.152: v65.12,53 64.74,52.62 63.49,52.62 C8.1 | U1.60 v74.74,64.25
  Route15 0.152: v65.12,53 70.89,58.76 70.89,59.18 71.24,59.53 71.57,59.53 74.74,62.7 v74.74,64.25
N$6
  Top 0.254: U1.9 68.24,68.8 B1.3
N$7
  Top 0.254: C2.2 B1.2
N$8
  Top 0.152: 67.69,71.3 B1.1
  Top 1.27: AN1.FEED C1.1 67.7,71.3 67.69,71.3
N$9
  Top 0.254: D1.A 52.58,47.95 R2.1
N$10
  Top 0.254: R10.1 59.37,49.92 D2.1
N$11  (via drill 0.61)
  Top 0.152: v41.49,63.5 S1.C | PS1.3 42.66,48.01 42.66,46.44 v42.63,46.41
  Bottom 0.152: v41.49,63.5 41.49,49.66 42.63,48.53 v42.63,46.41
N$12
  Top 0.254: D3.A 52.49,67.95 52.92,68.38 R5.1
N$13  (via drill 0.61)
  Top 0.152: R4.1 74.47,41.45 v74.47,41.53 | D11.1 80.07,42.92 v79.49,43.5
  Route2 0.152: v79.49,43.5 77.52,41.53 v74.47,41.53
N$14
  Top 0.254: D5.1 75.49,43.57 R6.1
N$15
  Top 0.254: J2.4 58.42,41.15 57.09,39.82 56.12,39.82 55.23,38.93 53.68,38.93 51.61,41 C5.1
N$16
  Top 0.762: MP2.2 35.39,34.52 Q1.D D6.2
N$17
  Top 0.762: MP3.2 85.34,34.52 Q2.D 80.49,37.52 D7.2
N$18
  Top 0.762: D8.2 Q3.D 83.6,84.47 MP4.2
N$19
  Top 0.762: D4.2 Q4.D 34.65,83.47 MP1.2
PCINT6
  Top 0.254: U1.42 69.24,55.64 68.51,54.9 68.51,52.09 71.21,49.39 71.65,49.39 71.81,49.23 71.81,49.18 72.49,48.5 75.42,48.5 R6.2
PE0(RXD0/PCINT8)  (via drill 0.35)
  Top 0.152: J2.2 56.22,40.85 v54.95,39.58 | U1.46 71.32,57.69 71.32,58.47 71.49,58.65 v71.49,58.93
  Bottom 0.152: v54.95,39.58 56.07,40.69 62.26,40.69 63.61,42.04 63.61,42.61 72.49,51.5 72.49,57.93 v71.49,58.93
PE1(TXD0)  (via drill 0.35)
  Top 0.152: U1.47 71.74,56.5 71.49,56.25 v71.28,56.25 | v54.99,46 53.74,44.75 J2.1
  Route2 0.152: v54.99,46 60.87,51.87 70.74,51.87 72.24,53.37 72.24,55.28 v71.28,56.25
PG0  (via drill 0.35)
  Top 0.152: R2.2 51.49,53 v52.49,54 | v65.87,66 65.87,66.37 65.74,66.5 U1.14
  Route2 0.152: v52.49,54 55.74,57.25 55.74,60.08 59.63,63.97 59.71,63.97 61.74,66 v65.87,66
PG1  (via drill 0.35)
  Top 0.152: v59.49,52 57.49,50 R10.2 | v65.99,60.5 66.37,60.87 66.37,64.62 65.24,65.75 U1.15
  Bottom 0.152: v59.49,52 60.87,53.37 60.87,55.25 62.49,56.87 62.49,57 v65.99,60.5
RESET  (via drill 0.35)
  Top 0.152: 63.93,49.56 61.37,47 53.71,47 49.38,42.67 49.38,42.19 49.25,42.06 49.16,42.06 C5.2 | U1.12 66.74,59.37 v66.37,59 | v61.49,54.12 60.49,53.12 R1.1 | SW1.1 75.49,52 75.49,50.25 76.62,49.12 76.62,48 75.87,47.25 73.37,47.25 71.62,45.5 67.87,45.5 65.87,47.5 J1.5
  Top 0.254: J1.5 63.93,49.56 60.49,53 R1.1
  Bottom 0.152: v66.37,59 64.42,57.04 64.42,56.98 64.01,56.58 63.95,56.58 v61.49,54.12
SCK
  Top 0.254: J1.3 67.48,48.55 67.48,54.9 67.07,55.32 67.07,56.4 66.74,56.73 U1.37
SCL  (via drill 0.35)
  Top 0.152: J4.3 55.34,63.18 56.6,64.44 59.09,64.44 | 54.32,56.05 v54.87,55.5 | U1.25 63.69,62.32 64.82,62.32 65,62.5 v65.49,62.5 | 59.09,64.44 59.49,64.03 U2.SCL | v59.64,64.64 59.43,64.44 59.09,64.44
  Top 0.254: J4.3 55.24,60.12 55.24,56.96 54.32,56.05 53.54,55.27 R14.1
  Bottom 0.152: J3.3 66.37,37.5 64.89,38.98 54.7,38.98 54.35,39.33 54.35,40.84 54.7,41.19 55.21,41.19 55.4,41 62.13,41 63.3,42.17 63.3,47.06 v54.87,55.5 | v65.49,62.5 63.35,64.64 v59.64,64.64
SDA  (via drill 0.61)
  Top 0.152: v58.76,62.13 58.99,61.89 U2.SDA | v51.49,56.28 51.49,57.54 J4.4 | U1.26 63.69,61.67 64.47,61.67 64.62,61.52 64.62,61.46 v65.05,61.03
  Top 0.254: R13.1 61.45,67.5 v61.49,67.5
  Bottom 0.152: 53.99,55.99 54.2,55.99 55.19,56.99 55.19,59.6 57.06,61.47 58.1,61.47 v58.76,62.13 59.16,61.72 64.36,61.72 v65.05,61.03 | 53.99,55.99 52.79,55.99 52.51,56.28 v51.49,56.28 | 53.99,55.99 53.99,55.5 63,46.49 63,42.3 62.01,41.3 55.52,41.3 55.33,41.5 54.58,41.5 54.04,40.96 54.04,39.21 54.58,38.67 62.69,38.67 J3.4
  Bottom 0.254: v58.76,62.13 59.05,62.42 59.05,64.88 61.49,67.32 v61.49,67.5
TOSC2
  Top 0.254: R5.2 56.07,69.5 58.1,67.47 58.98,67.47 59.71,66.74 59.71,65.83 60.01,65.53 60.89,65.53 61.61,66.25 U1.17
VBAT  (via drill 0.61)
  Top 0.762: v46.49,37.5 J3.10 | v80.49,76.5 D8.1 | v39.49,75.5 38.49,76.5 D4.1 | MP1.1 34.6,86.5 v35.49,86.5 | v35.49,78.5 34.06,78.5 C3.1 | MP4.1 85.89,84.9 v84.49,83.5 | v83.49,32.5 84.09,33.1 MP3.1 | MP2.1 33.09,34.9 v32.49,35.5 | v38.49,42.5 D6.1 | v77.49,84.5 77.49,84.45 R15.2 | S1.B 39.49,60.75 v39.49,59.5 | D7.1 85.09,38 v85.59,37.5 | B2.2 45.39,58.12 C12.2 45.39,52.64 PS1.1 40.62,50.45 40.54,50.52 39.47,50.52 v38.49,51.5
  pour Route15: 44.42,115.47 33.46,126.42 4.48,126.42 4.45,126.43 -7.51,138.39 -11.43,134.47 -11.43,-8.47 -5.47,-14.43 130.42,-14.43 130.42,115.47 113.49,132.39 74.57,93.47 74.57,77.53 78.56,73.54 78.57,73.51 78.57,44.48 78.56,44.45 74.54,40.43 74.51,40.42 44.48,40.42 44.45,40.43 41.43,43.45 41.42,43.48 41.42,74.51 41.43,74.54 44.42,77.53
(copper drawn outside any net)
  shapes: Bottom area x1, Route15 area x2, Route2 area x1, Top area x1